# Altium schematic sheet Analog_Digital_struct.SchDoc
size 420 x 297 mm; CheckedBy: Глазков В.В.; Author: Митр Д.В.; SheetNumber: 1; SheetTotal: 2
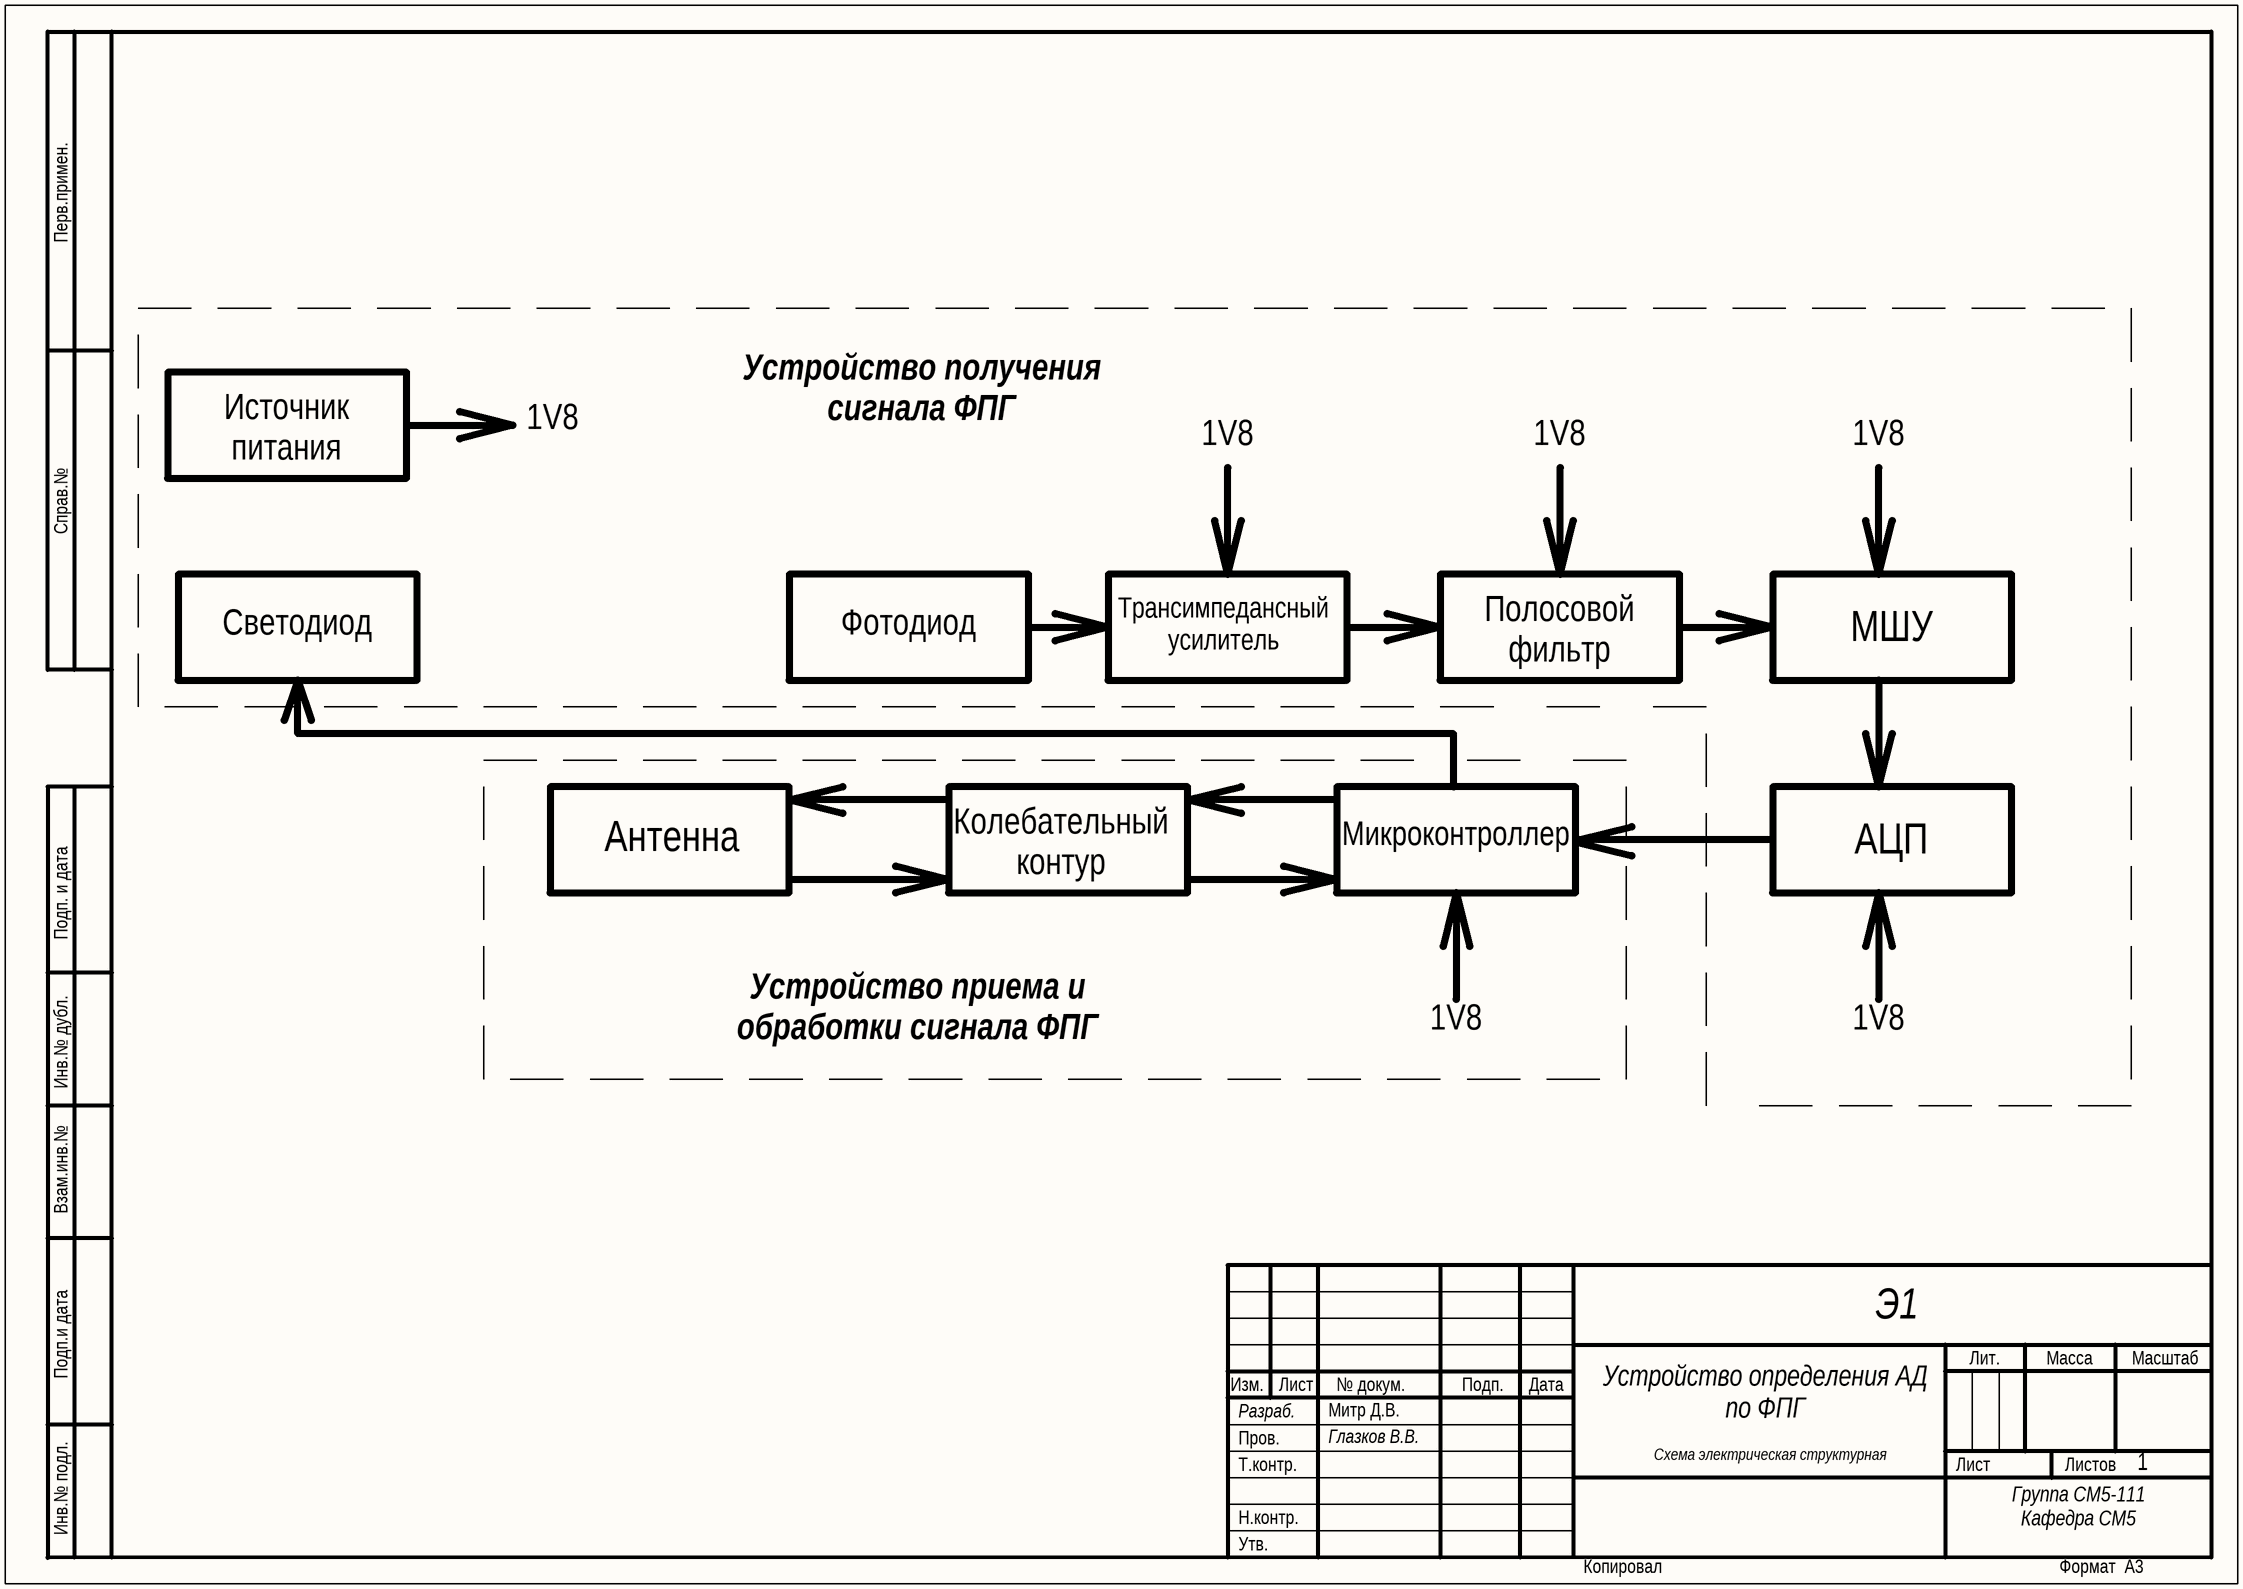
[diagram p0: Analog_Digital_struct.SchDoc]

## Notes on the sheet
- Источник питания
- 1V8
- Устройство получения
  сигнала ФПГ
- Светодиод
- Фотодиод
- Трансимпедансный усилитель
- Полосовой фильтр
- МШУ
- АЦП
- Антенна
- Колебательный контур
- Микроконтроллер
- Устройство приема и обработки сигнала ФПГ
- Э1
- Устройство определения АД по ФПГ
- 1
- Перв.примен.
- Справ.№
- Подп. и дата
- Инв.№ дубл.
- Взам.инв.№
- Подп.и дата
- Разраб.
- Изм.
- Лист
- № докум.
- Подп.
- Дата
- Лит.
- Масса
- Масштаб
- Т.контр.
- Пров.
- Митр Д.В.
- Глазков В.В.
- Схема электрическая структурная
- Листов
- Инв.№ подл.
- Утв.
- Н.контр.
- Группа СМ5-111
  Кафедра СМ5
  МГТУ им Н.Э.Баумана
- Копировал
- Формат  A3